# EAGLE schematic color_access_granter (EAGLE 9.0.0)
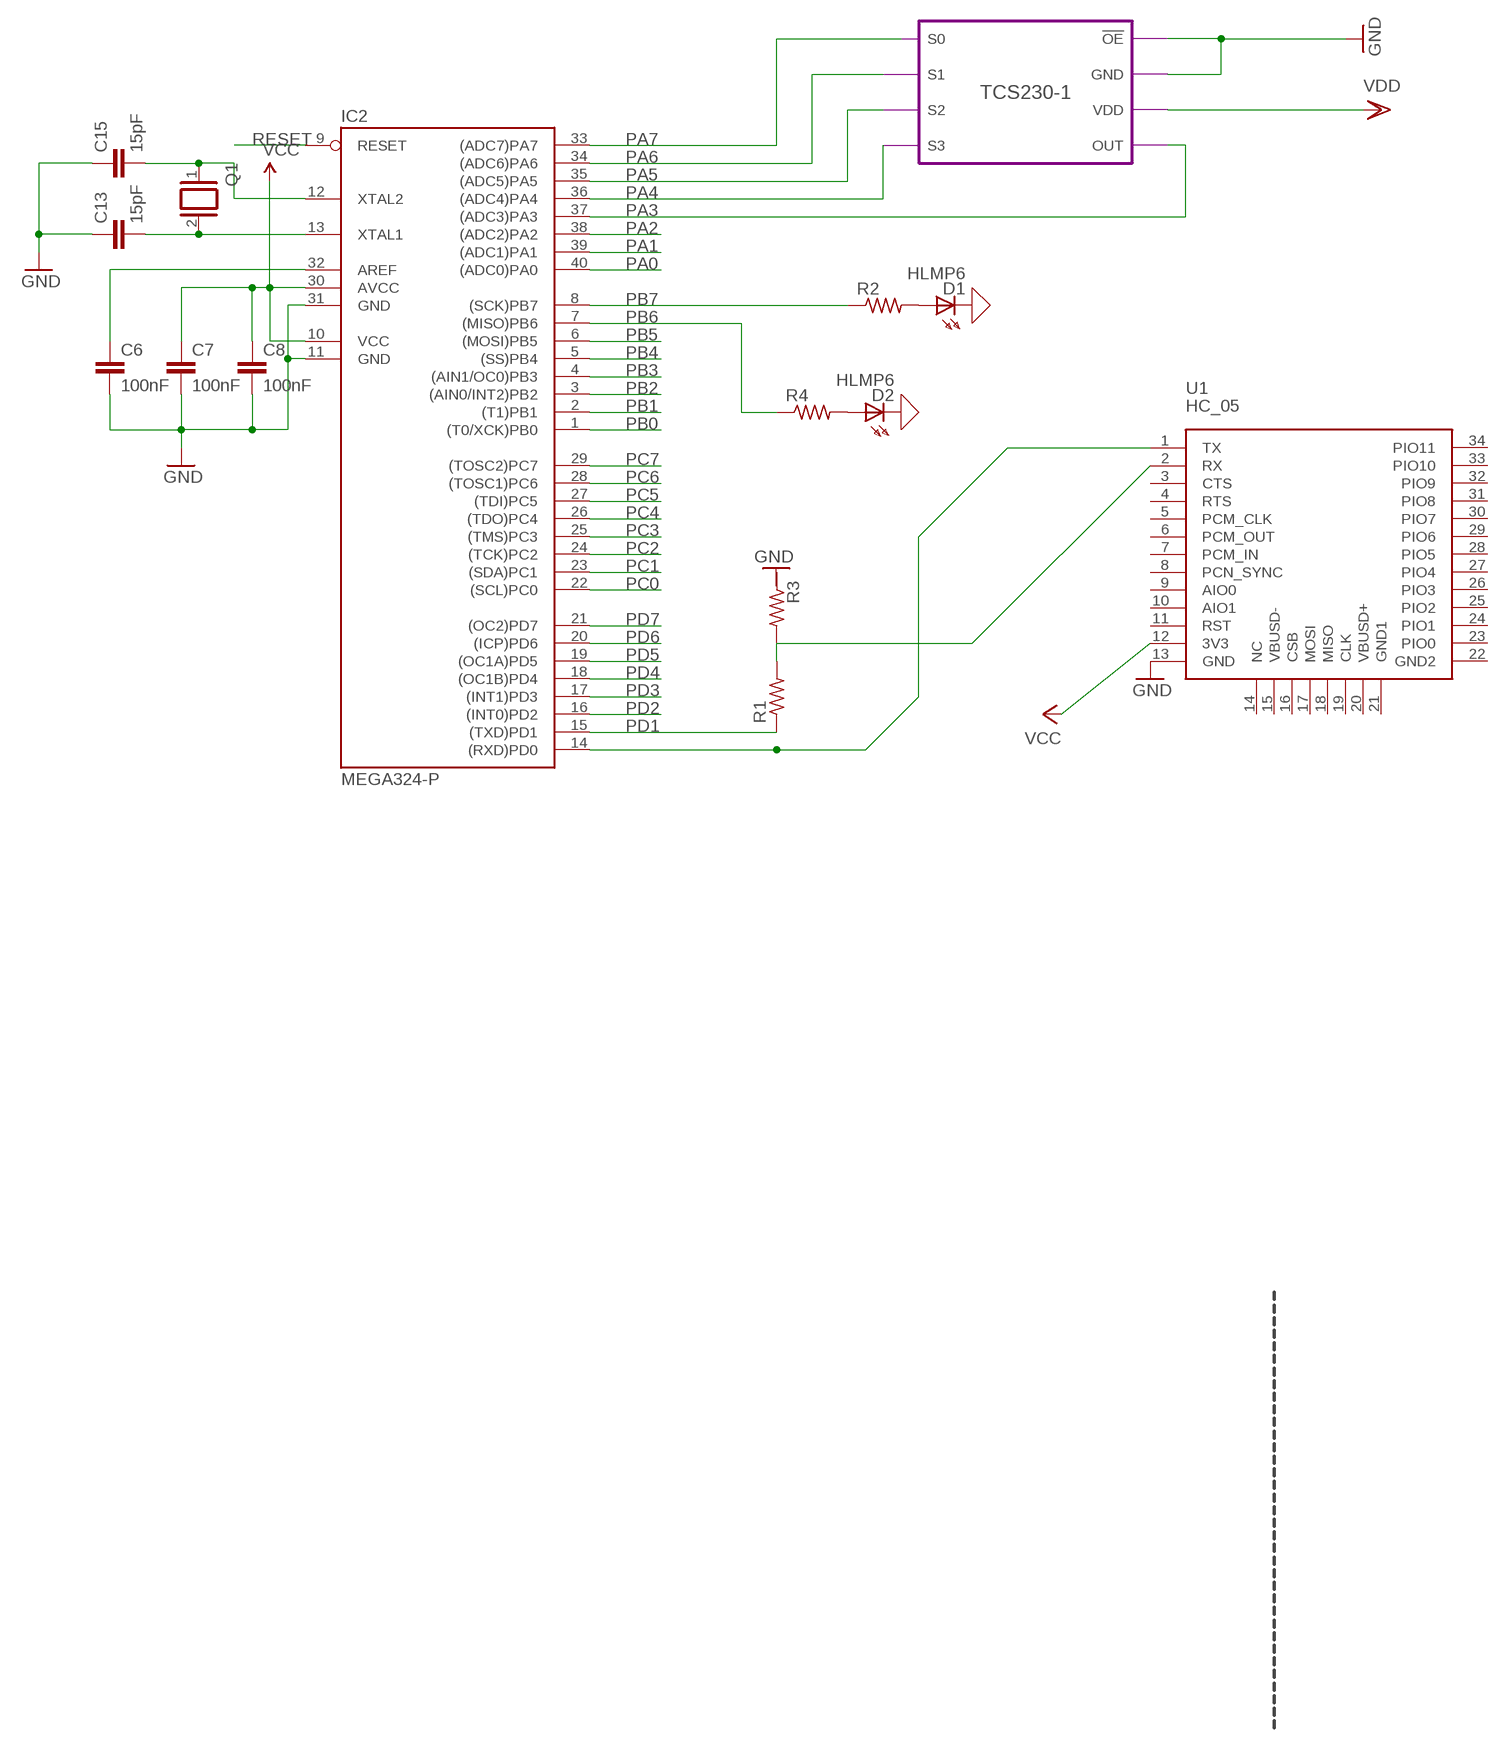
[diagram p0: schematic, sheet 1]

## Parts
C6  100nF  C-EUC_PM  [C025-025X050]
C7  100nF  C-EUC_PM  [C025-025X050]
C8  100nF  C-EUC_PM  [C025-025X050]
C13  15pF  C-EUC_PM  [C025-025X050]
C15  15pF  C-EUC_PM  [C025-025X050]
D1  HLMP6  [HLMP6]
D2  HLMP6  [HLMP6]
IC2  MEGA324-P  MEGA16-P  [DIL40]
Q1  XTAL/S  [QS]
R1  R-US_0411/12  [0411/12]
R2  R-US_0204/2V  [0204V]
R3  R-US_0411/12  [0411/12]
R4  R-US_0204/2V  [0204V]
U1  HC_05  [BLUETOOTH_SMD]

## Module instances
TCS230-1 = TCS230

## Nets
0: D1.K D2.K ; supply symbol labelled GND
GND: C6.2 C7.2 C8.2 C13.1 C15.1 IC2.11(GND) IC2.31(GND) U1.13(GND) ; port TCS230-1.GND TCS230-1.!OE
N$1: U1.2(RX)
N$3: D1.A R2.2
N$4: D2.A R4.2
N$5: IC2.14((RXD)PD0) U1.1(TX)
N$20: C6.1 IC2.32(AREF)
N$21: C13.2 IC2.13(XTAL1) Q1.2
N$22: C15.2 IC2.12(XTAL2) Q1.1
PA0: IC2.40((ADC0)PA0)
PA1: IC2.39((ADC1)PA1)
PA2: IC2.38((ADC2)PA2)
PA3: IC2.37((ADC3)PA3) ; port TCS230-1.OUT
PA4: IC2.36((ADC4)PA4) ; port TCS230-1.S3
PA5: IC2.35((ADC5)PA5) ; port TCS230-1.S2
PA6: IC2.34((ADC6)PA6) ; port TCS230-1.S1
PA7: IC2.33((ADC7)PA7)
PB0: IC2.1((T0/XCK)PB0)
PB1: IC2.2((T1)PB1)
PB2: IC2.3((AIN0/INT2)PB2)
PB3: IC2.4((AIN1/OC0)PB3)
PB4: IC2.5((SS)PB4)
PB5: IC2.6((MOSI)PB5)
PB6: IC2.7((MISO)PB6) R4.1
PB7: IC2.8((SCK)PB7) R2.1
PC0: IC2.22((SCL)PC0)
PC1: IC2.23((SDA)PC1)
PC2: IC2.24((TCK)PC2)
PC3: IC2.25((TMS)PC3)
PC4: IC2.26((TDO)PC4)
PC5: IC2.27((TDI)PC5)
PC6: IC2.28((TOSC1)PC6)
PC7: IC2.29((TOSC2)PC7)
PD1: IC2.15((TXD)PD1)
PD2: IC2.16((INT0)PD2)
PD3: IC2.17((INT1)PD3)
PD4: IC2.18((OC1B)PD4)
PD5: IC2.19((OC1A)PD5)
PD6: IC2.20((ICP)PD6)
PD7: IC2.21((OC2)PD7)
RESET: IC2.9(RESET)
VCC: C7.1 C8.1 IC2.10(VCC) IC2.30(AVCC) U1.12(3V3)
VDD: port TCS230-1.VDD
Unconnected: R1.1 R1.2 R3.1 R3.2 U1.3(CTS) U1.4(RTS) U1.5(PCM_CLK) U1.6(PCM_OUT) U1.7(PCM_IN) U1.8(PCN_SYNC) U1.9(AIO0) U1.10(AIO1) U1.11(RST) U1.14(NC) U1.15(VBUSD-) U1.16(CSB) U1.17(MOSI) U1.18(MISO) U1.19(CLK) U1.20(VBUSD+) U1.21(GND1) U1.22(GND2) U1.23(PIO0) U1.24(PIO1) U1.25(PIO2) U1.26(PIO3) U1.27(PIO4) U1.28(PIO5) U1.29(PIO6) U1.30(PIO7) U1.31(PIO8) U1.32(PIO9) U1.33(PIO10) U1.34(PIO11)

## Library data of the parts
C6-C8 C13 C15 = 0andrei_custom:C-EU: CAPACITOR, European symbol
D1 D2 = display-hp:HLMP6: LED 2mm horizontal; MF: AGILENT TECHNOLOGIES; MPN: HLMP-6500; OC_FARNELL: 1652490; OC_NEWARK: 40K0088
IC2 = atmel:MEGA16-P: MICROCONTROLLER 16 Kbytes FLASH 1 kbytes SRAM 512 bytes EEPROM USART 8-channel 10 bit ADC Source: avr.lbr; MPN: ATMEGA16-16PU; OC_FARNELL: 9171142; OC_NEWARK: 01M6885
Q1 = special:XTAL/S: CRYSTAL
R1-R4 = resistor:R-US_: RESISTOR, American symbol
U1 = Bluetooth HC-05:HC_05: HC-05 Bluetooth Module

## Module TCS230
Ports: S0(io) S1(io) S2(io) S3(io) !OE(io) GND(io) VDD(io) OUT(io)

### Library data of the parts